# Altium schematic sheet micro-ATMEGA32M1.SchDoc: ATMega32M1
size A4; DrawnBy: Dylan Vogel; Organization: UTAT SS; Revision: 1.0
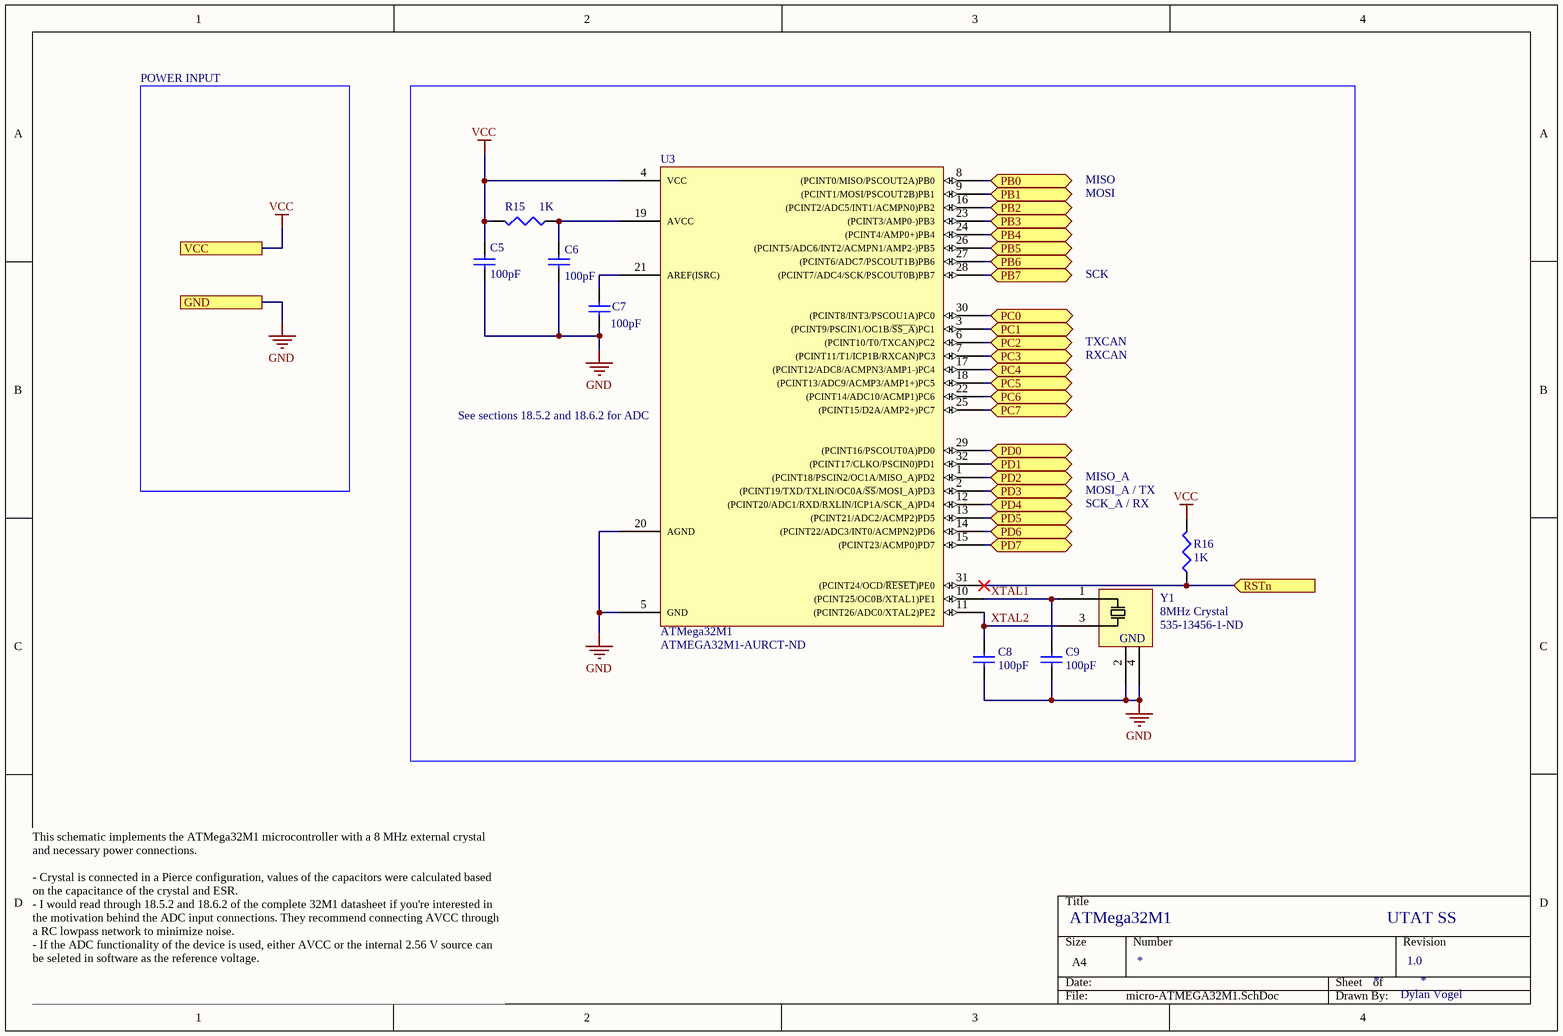
[diagram p0: micro-ATMEGA32M1.SchDoc]

## Parts
C5  value 100pF  [C1206]  (hidden comment: Cap Semi)
C6  value 100pF  [C1206]  (hidden comment: Cap Semi)
C7  value 100pF  [C1206]  (hidden comment: Cap Semi)
C8  value 100pF  [C1206]  (hidden comment: Cap Semi)
C9  value 100pF  [C1206]  (hidden comment: Cap Semi)
R15  value 1K  [J1-0603]  (hidden comment: Res3)
R16  value 1K  [J1-0603]  (hidden comment: Res3)
U3  ATMega32M1  Supplier Part Number 1: ATMEGA32M1-AURCT-ND  [QFP80P900X900X120-32]
Y1  8MHz Crystal  Supplier Part Number 1: 535-13456-1-ND  [OSCSC500X320X110-4N]

## Ports
GND, PB0 (bidir), PB1 (bidir), PB2 (bidir), PB3 (bidir), PB4 (bidir), PB5 (bidir), PB6 (bidir), PB7 (bidir), PC0 (bidir), PC1 (bidir), PC2 (bidir), PC3 (bidir), PC4 (bidir), PC5 (bidir), PC6 (bidir), PC7 (bidir), PD0 (bidir), PD1 (bidir), PD2 (bidir), PD3 (bidir), PD4 (bidir), PD5 (bidir), PD6 (bidir), PD7 (bidir), RSTn (in), VCC

## Nets
GND: C5.1 C6.1 C7.2 C8.1 C9.1 U3.5(GND) U3.20(AGND) Y1.2 Y1.4 ; port GND
VCC: C5.2 R15.2 R16.2 U3.4(VCC) ; port VCC
PB0: U3.8((PCINT0/MISO/PSCOUT2A)PB0) ; port PB0
PB1: U3.9((PCINT1/MOSI/PSCOUT2B)PB1) ; port PB1
PB2: U3.16((PCINT2/ADC5/INT1/ACMPN0)PB2) ; port PB2
PB3: U3.23((PCINT3/AMP0-)PB3) ; port PB3
PB4: U3.24((PCINT4/AMP0+)PB4) ; port PB4
PB5: U3.26((PCINT5/ADC6/INT2/ACMPN1/AMP2-)PB5) ; port PB5
PB6: U3.27((PCINT6/ADC7/PSCOUT1B)PB6) ; port PB6
PB7: U3.28((PCINT7/ADC4/SCK/PSCOUT0B)PB7) ; port PB7
PC0: U3.30((PCINT8/INT3/PSCOU1A)PC0) ; port PC0
PC1: U3.3((PCINT9/PSCIN1/OC1B/~{SS_A})PC1) ; port PC1
PC2: U3.6((PCINT10/T0/TXCAN)PC2) ; port PC2
PC3: U3.7((PCINT11/T1/ICP1B/RXCAN)PC3) ; port PC3
PC4: U3.17((PCINT12/ADC8/ACMPN3/AMP1-)PC4) ; port PC4
PC5: U3.18((PCINT13/ADC9/ACMP3/AMP1+)PC5) ; port PC5
PC6: U3.22((PCINT14/ADC10/ACMP1)PC6) ; port PC6
PC7: U3.25((PCINT15/D2A/AMP2+)PC7) ; port PC7
PD0: U3.29((PCINT16/PSCOUT0A)PD0) ; port PD0
PD1: U3.32((PCINT17/CLKO/PSCIN0)PD1) ; port PD1
PD2: U3.1((PCINT18/PSCIN2/OC1A/MISO_A)PD2) ; port PD2
PD3: U3.2((PCINT19/TXD/TXLIN/OC0A/~{SS}/MOSI_A)PD3) ; port PD3
PD4: U3.12((PCINT20/ADC1/RXD/RXLIN/ICP1A/SCK_A)PD4) ; port PD4
PD5: U3.13((PCINT21/ADC2/ACMP2)PD5) ; port PD5
PD6: U3.14((PCINT22/ADC3/INT0/ACMPN2)PD6) ; port PD6
PD7: U3.15((PCINT23/ACMP0)PD7) ; port PD7
RSTn: R16.1 U3.31((PCINT24/OCD/~{RESET})PE0) ; port RSTn
XTAL1: C9.2 U3.10((PCINT25/OC0B/XTAL1)PE1) Y1.1(IN)
XTAL2: C8.2 U3.11((PCINT26/ADC0/XTAL2)PE2) Y1.3(IN)
NetC6_2: C6.2 R15.1 U3.19(AVCC)
NetC7_1: C7.1 U3.21(AREF(ISRC))

## Notes on the sheet
- POWER INPUT
- MOSI
- MISO
- SCK
- TXCAN
- RXCAN
- (near U3) See sections 18.5.2 and 18.6.2 for ADC
- (near R16) MOSI_A / TX
- MISO_A
- (near R16) SCK_A / RX
- This schematic implements the ATMega32M1 microcontroller with a 8 MHz external crystal and necessary power connections.
  - Crystal is connected in a Pierce configuration, values of the capacitors were calculated based on the capacitance of the crystal and ESR.
  - I would read through 18.5.2 and 18.6.2 of the complete 32M1 datasheet if you're interested in the motivation behind the ADC input connections. They recommend connecting AVCC through a RC lowpass network to minimize noise.
  - If the ADC functionality of the device is used, either AVCC or the internal 2.56 V source can be seleted in software as the reference voltage.
- (in symbol AMB3B-8MHz) GND

## Library data of the parts
C5-C9 = Cap Semi: Capacitor (Semiconductor SIM Model); Published: 8-Jun-2000; LatestRevisionDate: 29-May-2009; LatestRevisionNote: IPC-7351 Footprint Added.; PackageReference: C1206; Publisher: Altium Limited; PackageDescription: Chip Capacitor
R15 R16 = Res3: Resistor; Published: 8-Jun-2000; LatestRevisionDate: 29-May-2009; LatestRevisionNote: IPC-7351 Footprint Added.; PackageReference: J1-0603; Publisher: Altium Limited; PackageDescription: Chip Resistor
U3 = ATMega32M1: Atmel 8-bit AVR microcontroller.; Supplier 1: Digi-Key
Y1 = AMB3B-8MHz: 8MHz Abracom 4-pin crystal.; Supplier 1: Digi-Key